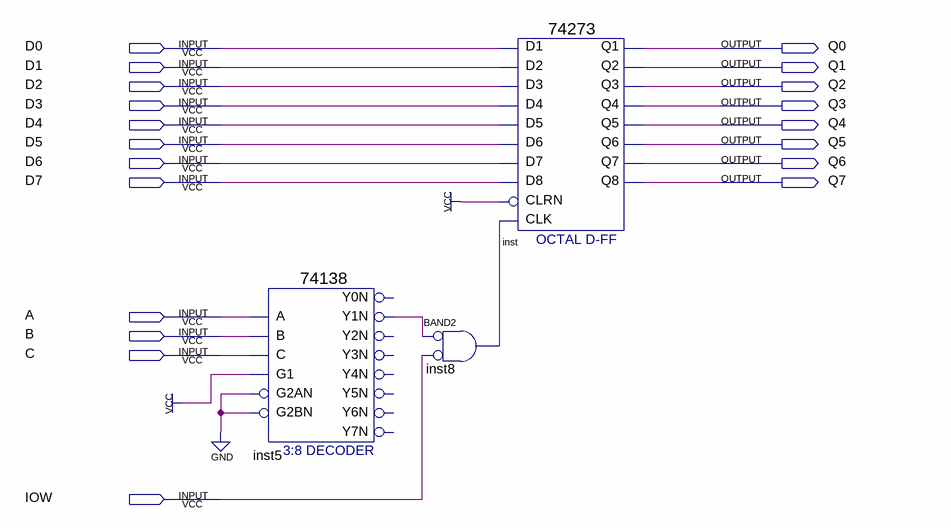
[diagram p0: schematic sheet]
// Quartus schematic project1.bdf as structural Verilog: 3 symbols, 20 pins
module project1 (
  input  D0,
  input  D1,
  input  D2,
  input  D3,
  input  D4,
  input  D5,
  input  D6,
  input  D7,
  input  A,
  input  B,
  input  C,
  input  IOW,
  output Q0,
  output Q1,
  output Q2,
  output Q3,
  output Q4,
  output Q5,
  output Q6,
  output Q7
);

  wire inst5_y1n, inst8_out;

  \74138  inst5 (
    .A(A), .B(B), .G1(1'b1), .C(C), .G2AN(1'b0), .G2BN(1'b0), .Y1N(inst5_y1n));  // open: Y0N, Y2N, Y3N, Y4N, Y5N, Y6N, Y7N
  and inst8 (inst8_out, ~inst5_y1n, ~IOW);  // BAND2
  \74273  inst (
    .D2(D1), .D3(D2), .D1(D0), .D4(D3), .D7(D6), .D6(D5), .D5(D4), .D8(D7), .CLK(inst8_out), .CLRN(1'b1),
    .Q4(Q3), .Q1(Q0), .Q2(Q1), .Q3(Q2), .Q6(Q5), .Q5(Q4), .Q7(Q6), .Q8(Q7));
endmodule
